# Altium project FMCW-Radar-v1.PrjPcb (part 1 of 3)
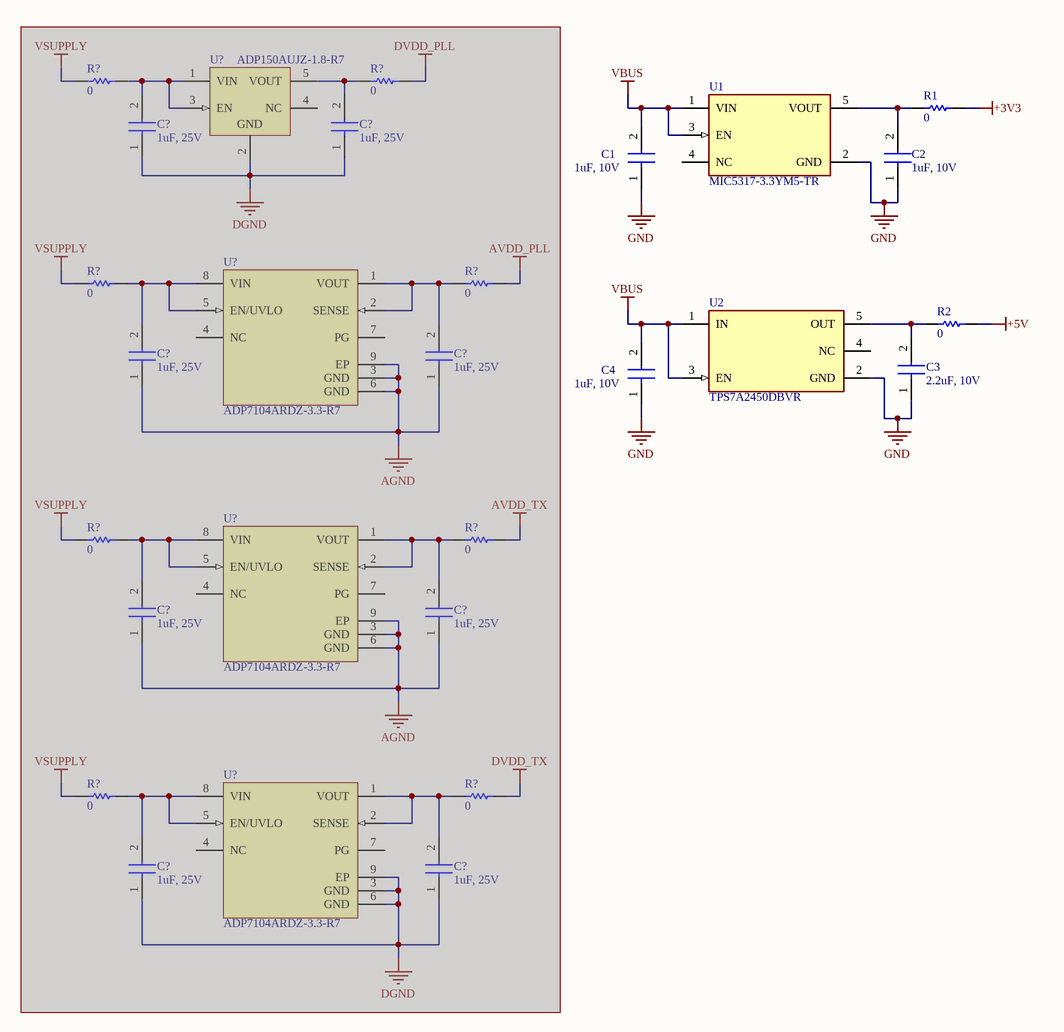
[diagram p0: Power.SchDoc]
4 sheets, 82 parts. Net scope: global (net labels, ports and power ports of the same name join across sheets).
Board file: Radar.PcbDoc
Sheets:
  Power.SchDoc
  Transmitter-2.4GHz.SchDoc
  Receiver-2.4GHz.SchDoc
  MCU.SchDoc

## Sheet Power.SchDoc
size B; SheetNumber: 1; SheetTotal: 4

### Parts
(Parts that share a designator on the sheet are numbered #1, #2 ... from top to bottom, then left to right.)
C1  1uF, 10V  [FP-CL10-IPC_A]
C2  1uF, 10V  [FP-CL10-IPC_A]
C3  2.2uF, 10V  [FP-CL10-IPC_A]
C4  1uF, 10V  [FP-CL10-IPC_A]
C?#1  1uF, 25V  [CAP_CL21B105KAFNNNE_SAM]  (masked out: inside a compile mask, not in the netlist)
C?#2  1uF, 25V  [CAP_CL21B105KAFNNNE_SAM]  (masked out: inside a compile mask, not in the netlist)
C?#3  1uF, 25V  [CAP_CL21B105KAFNNNE_SAM]  (masked out: inside a compile mask, not in the netlist)
C?#4  1uF, 25V  [CAP_CL21B105KAFNNNE_SAM]  (masked out: inside a compile mask, not in the netlist)
C?#5  1uF, 25V  [CAP_CL21B105KAFNNNE_SAM]  (masked out: inside a compile mask, not in the netlist)
C?#6  1uF, 25V  [CAP_CL21B105KAFNNNE_SAM]  (masked out: inside a compile mask, not in the netlist)
C?#7  1uF, 25V  [CAP_CL21B105KAFNNNE_SAM]  (masked out: inside a compile mask, not in the netlist)
C?#8  1uF, 25V  [CAP_CL21B105KAFNNNE_SAM]  (masked out: inside a compile mask, not in the netlist)
R1  0  [RESC1005X40X25ML05T05]
R2  0  [RESC1005X40X25ML05T05]
R?#1  0  [RES_ERJ-6GEY0R00V]  (masked out: inside a compile mask, not in the netlist)
R?#2  0  [RES_ERJ-6GEY0R00V]  (masked out: inside a compile mask, not in the netlist)
R?#3  0  [RES_ERJ-6GEY0R00V]  (masked out: inside a compile mask, not in the netlist)
R?#4  0  [RES_ERJ-6GEY0R00V]  (masked out: inside a compile mask, not in the netlist)
R?#5  0  [RES_ERJ-6GEY0R00V]  (masked out: inside a compile mask, not in the netlist)
R?#6  0  [RES_ERJ-6GEY0R00V]  (masked out: inside a compile mask, not in the netlist)
R?#7  0  [RES_ERJ-6GEY0R00V]  (masked out: inside a compile mask, not in the netlist)
R?#8  0  [RES_ERJ-6GEY0R00V]  (masked out: inside a compile mask, not in the netlist)
U1  MIC5317-3.3YM5-TR  [FP-SOT23-5LD-PL-1-IPC_C]
U2  TPS7A2450DBVR  [FP-DBV0005A-IPC_C]
U?#1  ADP150AUJZ-1.8-R7  (masked out: inside a compile mask, not in the netlist)
U?#2  ADP7104ARDZ-3.3-R7  [ADI-RD-8-2_M]  (masked out: inside a compile mask, not in the netlist)
U?#3  ADP7104ARDZ-3.3-R7  [ADI-RD-8-2_M]  (masked out: inside a compile mask, not in the netlist)
U?#4  ADP7104ARDZ-3.3-R7  [ADI-RD-8-2_M]  (masked out: inside a compile mask, not in the netlist)

### Nets
+3V3: R1.2
+5V: R2.2
GND: C1.1 C2.1 C3.1 C4.1 U1.2(GND) U2.2(GND)
VBUS: C1.2 C4.2 U1.1(VIN) U1.3(EN) U2.1(IN) U2.3(EN)
NetC2_2: C2.2 R1.1 U1.5(VOUT)
NetC3_2: C3.2 R2.1 U2.5(OUT)

Not connected (* = marked no-connect by the designer): U1 4(NC); U2 4(NC)

### Library data of the parts
C1 C2 C4 = CL10B105KP8NNNC: Ceramic Capacitor, Multilayer, Ceramic, 10V, 10% +Tol, 10% -Tol, X7R, 15% TC, 1uF, Surface Mount, 0603; Manufacturer: Samsung; Multilayer: Yes; Supplier: Digikey; Supplier Part Number: 1276-1946-6-ND; Manufacturer Part Number: CL10B105KP8NNNC; RoHS: Yes; Category: Ceramic Capacitors; Stock: 5561968; Pricing: 1=0.08, 10=0.006, 100=0.0056, 1000=0.00528 (USD); Mounting Technology: Surface Mount; Pins: 2; Dielectric Material: Ceramic; Package Shape: Rectangular; Case/Package: 0603; Terminal Finish: Nickel; Min Operating Temperature: -55°C; Max Operating Temperature: 125°C; JESD-609 Code: e3; Value: 1uF; Capacitor Type: Ceramic; Tolerance  (fill in as +-): 10%; Package Style: SMTMeter; Packaging: Tape and Reel; Tolerance (fill in as +-): 10%; Rated DC Voltage (URdc): 10V; Temperature Characteristics Code: X7R; Termination: Wraparound; Length: 1.6mm; Width: 0.8mm; Height: 0.9mm; Reach SVHC Compliant: Yes; RoHS Compliant: Yes; ComponentLink1URL: https://datasheet.ciiva.com:443/pdfs/VipMasterIC/IC/SEMS/SEMS-S-A0008526420/SEMS-S-A0008526450-1.pdf?src-supplier=IHS+Markit; ComponentLink1Description: https://datasheet.ciiva.com:443/pdfs/VipMasterIC/IC/SEMS/SEMS-S-A0008526420/SEMS-S-A0008526450-1.pdf?src-supplier=IHS+Markit; ComponentLink2URL: https://datasheet.ciiva.com/25788/cl10b105kp8nnnc-25788304.pdf?src-supplier=Digikey; ComponentLink2Description: https://datasheet.ciiva.com/25788/cl10b105kp8nnnc-25788304.pdf?src-supplier=Digikey; ComponentLink3URL: https://datasheet.ciiva.com/26838/getdatasheetpartid-358410-26838426.pdf?src-supplier=Verical; ComponentLink3Description: https://datasheet.ciiva.com/26838/getdatasheetpartid-358410-26838426.pdf?src-supplier=Verical; ComponentLink4URL: https://datasheet.ciiva.com/16396/cl10b105kp8nnnc-16396970.pdf?src-supplier=Future+Electronics; ComponentLink4Description: https://datasheet.ciiva.com/16396/cl10b105kp8nnnc-16396970.pdf?src-supplier=Future+Electronics
C3 = CL10B225KP8NNNC: Ceramic Capacitor, Multilayer, Ceramic, 10V, 10% +Tol, 10% -Tol, X7R, 15% TC, 2.2uF, Surface Mount, 0603; Manufacturer: Samsung; Multilayer: Yes; Supplier: Digikey; Supplier Part Number: 1276-1134-1-ND; Manufacturer Part Number: CL10B225KP8NNNC; RoHS: Yes; Category: Ceramic Capacitors; Stock: 86850; Pricing: 1=0.08, 10=0.017, 100=0.0136, 1000=0.01206 (USD); Mounting Technology: Surface Mount; Pins: 2; Dielectric Material: Ceramic; Package Shape: Rectangular; Case/Package: 0603; Terminal Finish: Nickel; Min Operating Temperature: -55°C; Max Operating Temperature: 125°C; JESD-609 Code: e3; Value: 2.2uF; Capacitor Type: Ceramic; Tolerance  (fill in as +-): 10%; Package Style: SMTMeter; Packaging: Tape and Reel; Tolerance (fill in as +-): 10%; Rated DC Voltage (URdc): 10V; Temperature Characteristics Code: X7R; Termination: Wraparound; Length: 1.6mm; Width: 0.8mm; Height: 0.9mm; Reach SVHC Compliant: Yes; RoHS Compliant: Yes; ComponentLink1URL: https://datasheet.ciiva.com:443/pdfs/VipMasterIC/IC/SEMS/SEMS-S-A0008384515/SEMS-S-A0008873307-1.pdf?src-supplier=IHS+Markit; ComponentLink1Description: https://datasheet.ciiva.com:443/pdfs/VipMasterIC/IC/SEMS/SEMS-S-A0008384515/SEMS-S-A0008873307-1.pdf?src-supplier=IHS+Markit; ComponentLink2URL: https://datasheet.ciiva.com/25798/cl10b225kp8nnnc-25798914.pdf?src-supplier=Digikey; ComponentLink2Description: https://datasheet.ciiva.com/25798/cl10b225kp8nnnc-25798914.pdf?src-supplier=Digikey; ComponentLink3URL: https://datasheet.ciiva.com/15227/getdatasheetpartid-359568-15227195.pdf?src-supplier=Verical; ComponentLink3Description: https://datasheet.ciiva.com/15227/getdatasheetpartid-359568-15227195.pdf?src-supplier=Verical; ComponentLink4URL: https://datasheet.ciiva.com/16500/cl10b225kp8nnnc-16500695.pdf?src-supplier=Future+Electronics; ComponentLink4Description: https://datasheet.ciiva.com/16500/cl10b225kp8nnnc-16500695.pdf?src-supplier=Future+Electronics; ComponentLink5URL: https://datasheet.ciiva.com/29198/457933-da-01-en-vs-kondensator-0603-29198589.pdf?src-supplier=Conrad; ComponentLink5Description: https://datasheet.ciiva.com/29198/457933-da-01-en-vs-kondensator-0603-29198589.pdf?src-supplier=Conrad
C?#1-C?#8 = CL21B105KAFNNNE: Ceramic Capacitor, Multilayer, Ceramic, 25V, 10% +Tol, 10% -Tol, X7R, 15% TC, 1uF, Surface Mount, 0805; Manufacturer: Samsung; Multilayer: Yes; Supplier: Digikey; Supplier Part Number: 1276-1066-1-ND; Manufacturer Part Number: CL21B105KAFNNNE; RoHS: Yes; Category: Ceramic Capacitors; Stock: 34526; Pricing: 1=0.08, 10=0.026, 100=0.0192, 1000=0.0144, 2000=0.00735 (USD); Mounting Technology: Surface Mount; Pins: 2; Dielectric Material: Ceramic; Package Shape: Rectangular; Case/Package: 0805; Terminal Finish: Nickel; Min Operating Temperature: -55°C; Max Operating Temperature: 125°C; JESD-609 Code: e3; Value: 1uF; Capacitor Type: Ceramic; Tolerance  (fill in as +-): 10%; Package Style: SMTMeter; Packaging: Tape and Reel; Tolerance (fill in as +-): 10%; Rated DC Voltage (URdc): 25V; Temperature Characteristics Code: X7R; Termination: Wraparound; Length: 2mm; Width: 1.25mm; Height: 1.35mm; Reach SVHC Compliant: Yes; RoHS Compliant: Yes; ComponentLink1URL: https://datasheet.ciiva.com:443/pdfs/VipMasterIC/IC/SEMS/SEMS-S-A0008523501/SEMS-S-A0008523563-1.pdf?src-supplier=IHS+Markit; ComponentLink1Description: https://datasheet.ciiva.com:443/pdfs/VipMasterIC/IC/SEMS/SEMS-S-A0008523501/SEMS-S-A0008523563-1.pdf?src-supplier=IHS+Markit; ComponentLink2URL: https://datasheet.ciiva.com/25800/cl21b105kafnnne-25800163.pdf?src-supplier=Digikey; ComponentLink2Description: https://datasheet.ciiva.com/25800/cl21b105kafnnne-25800163.pdf?src-supplier=Digikey; ComponentLink3URL: https://datasheet.ciiva.com/15195/getdatasheetpartid-355205-15195880.pdf?src-supplier=Verical; ComponentLink3Description: https://datasheet.ciiva.com/15195/getdatasheetpartid-355205-15195880.pdf?src-supplier=Verical
R1 R2 = ERJ-3GEY0R00V: Fixed Resistor, Metal Glaze/thick Film, 0.1W, 0ohm, Surface Mount, 0603; Manufacturer: Panasonic; Power: 100mW; Rated Temperature: 70°C; Value: 0R; Package Height: 0.45mm; Package Length: 1.6mm; Package Width: 0.8mm; Reference Standard: AEC-Q200; Supplier: Digikey; Supplier Part Number: P0.0GCT-ND; Manufacturer Part Number: ERJ-3GEY0R00V; RoHS: Yes; Category: Chip SMD Resistors; Stock: 690397; Pricing: 1=0.1, 10=0.02, 25=0.0164, 50=0.0144, 100=0.0126, 250=0.0106, 500=0.00936, 1000=0.0083, 5000=0.0064, 10000=0.00578, 15000=0.00546, 25000=0.0051, 35000=0.00489, 50000=0.00468, 125000=0.00421, 250000=0.00392, 500000=0.00367 (USD); Mounting Technology: Surface Mount; Pins: 2; Package Shape: Rectangular; Case/Package: 0603; Terminal Finish: Nickel; Min Operating Temperature: -55°C; Max Operating Temperature: 155°C; JESD-609 Code: e3; Resistor Type: FIXED RESISTOR; Construction: Rectangular; Packaging: Tape and Reel; Technology: METAL GLAZE/THICK FILM; Termination: Wraparound; Reach SVHC Compliant: Yes; RoHS Compliant: Yes; ComponentLink1URL: https://datasheet.ciiva.com:443/pdfs/VipMasterIC/IC/PANA/PANA-S-A0009459603/PANA-S-A0009459603-1.pdf?src-supplier=IHS+Markit; ComponentLink1Description: https://datasheet.ciiva.com:443/pdfs/VipMasterIC/IC/PANA/PANA-S-A0009459603/PANA-S-A0009459603-1.pdf?src-supplier=IHS+Markit; ComponentLink2URL: https://datasheet.ciiva.com/11808/0900766b80f806dd-11808207.pdf?src-supplier=Rs; ComponentLink2Description: https://datasheet.ciiva.com/11808/0900766b80f806dd-11808207.pdf?src-supplier=Rs; ComponentLink3URL: https://datasheet.ciiva.com/27055/1935748-27055113.pdf?src-supplier=Jameco; ComponentLink3Description: https://datasheet.ciiva.com/27055/1935748-27055113.pdf?src-supplier=Jameco; ComponentLink4URL: https://datasheet.ciiva.com/43460/1678796-43460647.pdf?src-supplier=Farnell; ComponentLink4Description: https://datasheet.ciiva.com/43460/1678796-43460647.pdf?src-supplier=Farnell; ComponentLink5URL: https://datasheet.ciiva.com/28695/1678796-28695833.pdf?src-supplier=Element14; ComponentLink5Description: https://datasheet.ciiva.com/28695/1678796-28695833.pdf?src-supplier=Element14; ComponentLink6URL: https://datasheet.ciiva.com/5959/1678796-5959707.pdf?src-supplier=Farnell; ComponentLink6Description: https://datasheet.ciiva.com/5959/1678796-5959707.pdf?src-supplier=Farnell; ComponentLink7URL: https://datasheet.ciiva.com/48532/aoa0000ce1-48532165.pdf?src-supplier=Avnet; ComponentLink7Description: https://datasheet.ciiva.com/48532/aoa0000ce1-48532165.pdf?src-supplier=Avnet; ComponentLink8URL: https://datasheet.ciiva.com/30199/4aoa0000ce1-30199822.pdf?src-supplier=Onlinecomponents.com; ComponentLink8Description: https://datasheet.ciiva.com/30199/4aoa0000ce1-30199822.pdf?src-supplier=Onlinecomponents.com; ComponentLink9URL: https://datasheet.ciiva.com/16834/aoa0000ce1-16834828.pdf?src-supplier=Future+Electronics; ComponentLink9Description: https://datasheet.ciiva.com/16834/aoa0000ce1-16834828.pdf?src-supplier=Future+Electronics; ComponentLink10URL: https://datasheet.ciiva.com/16758/70255313-16758527.pdf?src-supplier=Allied+Electronics; ComponentLink10Description: https://datasheet.ciiva.com/16758/70255313-16758527.pdf?src-supplier=Allied+Electronics; ComponentLink11URL: https://datasheet.ciiva.com/46377/1678796-46377868.pdf?src-supplier=Element14; ComponentLink11Description: https://datasheet.ciiva.com/46377/1678796-46377868.pdf?src-supplier=Element14; ComponentLink12URL: https://datasheet.ciiva.com/9198/aoa0000ce1-9198975.pdf?src-supplier=Avnet; ComponentLink12Description: https://datasheet.ciiva.com/9198/aoa0000ce1-9198975.pdf?src-supplier=Avnet
R?#1-R?#8 = ERJ-6GEY0R00V: Fixed Resistor, Metal Glaze/thick Film, 0.125W, 0ohm, Surface Mount, 0805; Manufacturer: Panasonic; Power: 125mW; Rated Temperature: 70°C; Value: 0R; Package Height: 0.6mm; Package Length: 2mm; Package Width: 1.25mm; Reference Standard: AEC-Q200; Supplier: Digikey; Supplier Part Number: P0.0ACT-ND; Manufacturer Part Number: ERJ-6GEY0R00V; RoHS: Yes; Category: Chip SMD Resistors; Stock: 3178323; Pricing: 1=0.1, 10=0.028, 25=0.0236, 50=0.0204, 100=0.0179, 250=0.01516, 500=0.01342, 1000=0.01193 (USD); Mounting Technology: Surface Mount; Pins: 2; Package Shape: Rectangular; Case/Package: 0805; Terminal Finish: Nickel; Min Operating Temperature: -55°C; Max Operating Temperature: 155°C; JESD-609 Code: e3; Resistor Type: FIXED RESISTOR; Construction: Rectangular; Packaging: Tape and Reel; Technology: METAL GLAZE/THICK FILM; Termination: Wraparound; Reach SVHC Compliant: Yes; RoHS Compliant: Yes; ComponentLink1URL: https://datasheet.ciiva.com:443/pdfs/VipMasterIC/IC/PANA/PANA-S-A0009459603/PANA-S-A0009459603-1.pdf?src-supplier=IHS+Markit; ComponentLink1Description: https://datasheet.ciiva.com:443/pdfs/VipMasterIC/IC/PANA/PANA-S-A0009459603/PANA-S-A0009459603-1.pdf?src-supplier=IHS+Markit; ComponentLink2URL: https://datasheet.ciiva.com/11821/0900766b80f806dd-11821735.pdf?src-supplier=Rs; ComponentLink2Description: https://datasheet.ciiva.com/11821/0900766b80f806dd-11821735.pdf?src-supplier=Rs; ComponentLink3URL: https://datasheet.ciiva.com/28695/1678796-28695877.pdf?src-supplier=Element14; ComponentLink3Description: https://datasheet.ciiva.com/28695/1678796-28695877.pdf?src-supplier=Element14; ComponentLink4URL: https://datasheet.ciiva.com/46377/1678796-46377866.pdf?src-supplier=Element14; ComponentLink4Description: https://datasheet.ciiva.com/46377/1678796-46377866.pdf?src-supplier=Element14; ComponentLink5URL: https://datasheet.ciiva.com/43460/1678796-43460073.pdf?src-supplier=Farnell; ComponentLink5Description: https://datasheet.ciiva.com/43460/1678796-43460073.pdf?src-supplier=Farnell; ComponentLink6URL: https://datasheet.ciiva.com/9117/aoa0000ce1-9117354.pdf?src-supplier=Avnet; ComponentLink6Description: https://datasheet.ciiva.com/9117/aoa0000ce1-9117354.pdf?src-supplier=Avnet
U1 = MIC5317-3.3YM5-TR: Fixed Positive LDO Regulator, 3.3V, 0.31V Dropout, CMOS, PDSO5; Manufacturer: Microchip; Package Body Material: Plastic; Dropout Voltage1-Max: 310mV; Max Supply Voltage: 6V; Min Input Voltage: 4.3V; Channels: 1; Output Current1-Max: 150mA; Output Voltage1-Max: 3.399V; Output Voltage1-Min: 3.201V; Regulator Type: FIXED POSITIVE SINGLE OUTPUT LDO REGULATOR; Supplier: Digikey; Supplier Part Number: MIC5317-3.3YM5-CT-ND; Manufacturer Part Number: MIC5317-3.3YM5-TR; RoHS: No; Category: Voltage Regulators - Linear; Stock: 26650; Pricing: 1=0.22, 25=0.18, 100=0.16, 3000=0.16 (USD); Case/Package: LSSOP; Pins: 5; Package Shape: Rectangular; JESD-30 Code: R-PDSO-G5; Operating Temperature, TJ-Max: 125°C; Operating Temperature, TJ-Min: -40°C; Output Voltage1-Nom: 3.3V; Package Style: SMALL OUTLINE, LOW PROFILE, SHRINK PITCHMeter; Surface Mount: Yes; Technology: CMOS; Terminal Form: Gull Wing; Terminal Position: DUAL; Length: 2.9mm; Width: 1.6mm; Height - Seated (Max): 1.45mm; Terminal Pitch: 0.95mm; Reach SVHC Compliant: Yes; ComponentLink1URL: https://datasheet.ciiva.com:443/pdfs/VipMasterIC/IC/MCRL/MCRLS06213/MCRLS06213-1.pdf?src-supplier=IHS+Markit; ComponentLink1Description: https://datasheet.ciiva.com:443/pdfs/VipMasterIC/IC/MCRL/MCRLS06213/MCRLS06213-1.pdf?src-supplier=IHS+Markit; ComponentLink2URL: http://components.arrow.com/part/dataview/62845788S774067N1374?src-supplier=Arrow+Electronics; ComponentLink2Description: http://components.arrow.com/part/dataview/62845788S774067N1374?src-supplier=Arrow+Electronics; ComponentLink3URL: http://www.microchip.com/mymicrochip/filehandler.aspx?ddocname=en579427&src-supplier=Digikey; ComponentLink3Description: http://www.microchip.com/mymicrochip/filehandler.aspx?ddocname=en579427&src-supplier=Digikey; ComponentLink4URL: https://datasheet.octopart.com/MIC5317-3.3YM5-TR-Microchip-datasheet-26354330.pdf?src-supplier=Element14; ComponentLink4Description: https://datasheet.octopart.com/MIC5317-3.3YM5-TR-Microchip-datasheet-26354330.pdf?src-supplier=Element14
U2 = TPS7A2450DBVR: Fixed Positive LDO Regulator, 5V, 0.25V Dropout, PDSO5; Manufacturer: Texas Instruments; Supplier: Digikey; Supplier Part Number: 296-TPS7A2450DBVRCT-ND; Manufacturer Part Number: TPS7A2450DBVR; RoHS: Yes; Category: Voltage Regulators - Linear; Stock: 4495; Pricing: 1=0.52, 10=0.362, 25=0.324, 100=0.2817, 250=0.26148, 500=0.24932, 1000=0.23931 (USD); ComponentLink1URL: http://www.ti.com/general/docs/suppproductinfo.tsp?distId=10&amp;gotoUrl=http%3A%2F%2Fwww.ti.com%2Flit%2Fgpn%2Ftps7a24&src-supplier=Digikey; ComponentLink1Description: http://www.ti.com/general/docs/suppproductinfo.tsp?distId=10&amp;gotoUrl=http%3A%2F%2Fwww.ti.com%2Flit%2Fgpn%2Ftps7a24&src-supplier=Digikey
U?#1 = ADP150AUJZ-1.8-R7: Fixed Positive LDO Regulator, 1.8V, CMOS, PDSO5; Manufacturer: Analog Devices; Package Body Material: Plastic; Dropout Voltage1-Nom: 105mV; Input Voltage Absolute-Max: 6.5V; Max Supply Voltage: 5.5V; Min Input Voltage: 2.2V; Channels: 1; Output Current1-Max: 150mA; Output Voltage1-Max: 1.827V; Output Voltage1-Min: 1.755V; Package Equivalence Code: TSOP5/6,.11,37; Regulator Type: FIXED POSITIVE SINGLE OUTPUT LDO REGULATOR; Time @ Peak Reflow Temperature-Max (s): 40s; Voltage Tolerance-Max: 2.5%; Qualification Status: Not Qualified; Supplier: Mouser; Supplier Part Number: 584-ADP150AUJZ-1.8R7; Manufacturer Part Number: ADP150AUJZ-1.8-R7; RoHS: Yes; Category: Voltage Regulators - Linear; Stock: 3489; Pricing: 1=1.24, 10=0.902, 50=0.817, 100=0.723, 1000=0.605, 10000=0.559 (USD); Case/Package: VSSOP; Pins: 5; Package Shape: Rectangular; Terminal Finish: Tin; JESD-609 Code: e3; Adjustability: FIXED; JESD-30 Code: R-PDSO-G5; Moisture Sensitivity Level: 1; Number of Outputs: 1; Operating Temperature, TJ-Max: 125°C; Operating Temperature, TJ-Min: -40°C; Output Voltage1-Nom: 1.8V; Packaging: Tape and Reel; Peak Reflow Temperature (Cel): 260°C; Surface Mount: Yes; Technology: CMOS; Terminal Form: Gull Wing; Terminal Position: DUAL; Length: 2.9mm; Width: 1.6mm; Height - Seated (Max): 1mm; Terminal Pitch: 0.95mm; Reach SVHC Compliant: Yes; RoHS Compliant: Yes; ComponentLink1URL: https://datasheet.ciiva.com:443/pdfs/VipMasterIC/IC/ANDI/ANDI-S-A0001491086/ANDI-S-A0001491086-1.pdf?src-supplier=IHS+Markit; ComponentLink1Description: https://datasheet.ciiva.com:443/pdfs/VipMasterIC/IC/ANDI/ANDI-S-A0001491086/ANDI-S-A0001491086-1.pdf?src-supplier=IHS+Markit; ComponentLink2URL: https://datasheet.ciiva.com/2040/adp150-2040604.pdf?src-supplier=Digikey; ComponentLink2Description: https://datasheet.ciiva.com/2040/adp150-2040604.pdf?src-supplier=Digikey; ComponentLink3URL: https://datasheet.ciiva.com/2040/adp150-2040605.pdf?src-supplier=Digikey; ComponentLink3Description: https://datasheet.ciiva.com/2040/adp150-2040605.pdf?src-supplier=Digikey; ComponentLink4URL: https://datasheet.ciiva.com/2040/adp150-2040606.pdf?src-supplier=Digikey; ComponentLink4Description: https://datasheet.ciiva.com/2040/adp150-2040606.pdf?src-supplier=Digikey
U?#2-U?#4 = ADP7104ARDZ-3.3-R7: Fixed Positive LDO Regulator, 3.3V, 0.55V Dropout, CMOS, PDSO8; Manufacturer: Analog Devices; Package Body Material: Plastic; Dropout Voltage1-Nom: 350mV; Channels: 1; Output Current1-Max: 500mA; Output Voltage1-Max: 3.333V; Output Voltage1-Min: 3.234V; Package Equivalence Code: SOP8,.25; Regulator Type: FIXED POSITIVE SINGLE OUTPUT LDO REGULATOR; Dropout Voltage1-Max: 550mV; Input Voltage Absolute-Max: 22V; Max Supply Voltage: 20V; Line Regulation-Max: 0.0078%; Voltage Tolerance-Max: 2%; Qualification Status: Not Qualified; Supplier: Digikey; Supplier Part Number: 505-ADP7104ARDZ-3.3-R7CT-ND; Manufacturer Part Number: ADP7104ARDZ-3.3-R7; RoHS: Yes; Category: Voltage Regulators - Linear; Stock: 2731; Pricing: 1=7, 10=4.65, 25=4.0376, 100=3.3446, 250=3.00444, 500=2.825 (USD); Case/Package: HSOP; Pins: 8; Package Shape: Rectangular; Terminal Finish: Tin; Adjustability: FIXED; JESD-30 Code: R-PDSO-G8; Operating Temperature, TJ-Max: 125°C; Operating Temperature, TJ-Min: -40°C; Package Style: SMALL OUTLINE, HEAT SINK/SLUGMeter; Packaging: Tape and Reel; Surface Mount: Yes; Technology: CMOS; Terminal Form: Gull Wing; Terminal Position: DUAL; Min Input Voltage: 3.3V; Number of Outputs: 1; Output Voltage1-Nom: 3.3V; JESD-609 Code: e3; Moisture Sensitivity Level: 3; Length: 4.9mm; Width: 3.9mm; Height - Seated (Max): 1.75mm; Terminal Pitch: 1.27mm; Reach SVHC Compliant: Yes; RoHS Compliant: Yes; ComponentLink1URL: https://datasheet.ciiva.com:443/pdfs/VipMasterIC/IC/ANDI/ANDI-S-A0008998722/ANDI-S-A0008998722-1.pdf?src-supplier=IHS+Markit; ComponentLink1Description: https://datasheet.ciiva.com:443/pdfs/VipMasterIC/IC/ANDI/ANDI-S-A0008998722/ANDI-S-A0008998722-1.pdf?src-supplier=IHS+Markit; ComponentLink2URL: https://datasheet.ciiva.com/6589/adp7104-6589770.pdf?src-supplier=Digikey; ComponentLink2Description: https://datasheet.ciiva.com/6589/adp7104-6589770.pdf?src-supplier=Digikey; ComponentLink3URL: https://datasheet.ciiva.com/6589/adp7104-6589771.pdf?src-supplier=Digikey; ComponentLink3Description: https://datasheet.ciiva.com/6589/adp7104-6589771.pdf?src-supplier=Digikey; ComponentLink4URL: https://datasheet.ciiva.com/6589/adp7104-6589773.pdf?src-supplier=Digikey; ComponentLink4Description: https://datasheet.ciiva.com/6589/adp7104-6589773.pdf?src-supplier=Digikey; ComponentLink5URL: https://datasheet.ciiva.com/8241/adp7104-8241802.pdf?src-supplier=Avnet; ComponentLink5Description: https://datasheet.ciiva.com/8241/adp7104-8241802.pdf?src-supplier=Avnet

## Sheet Transmitter-2.4GHz.SchDoc
size B; SheetNumber: 2; SheetTotal: 4
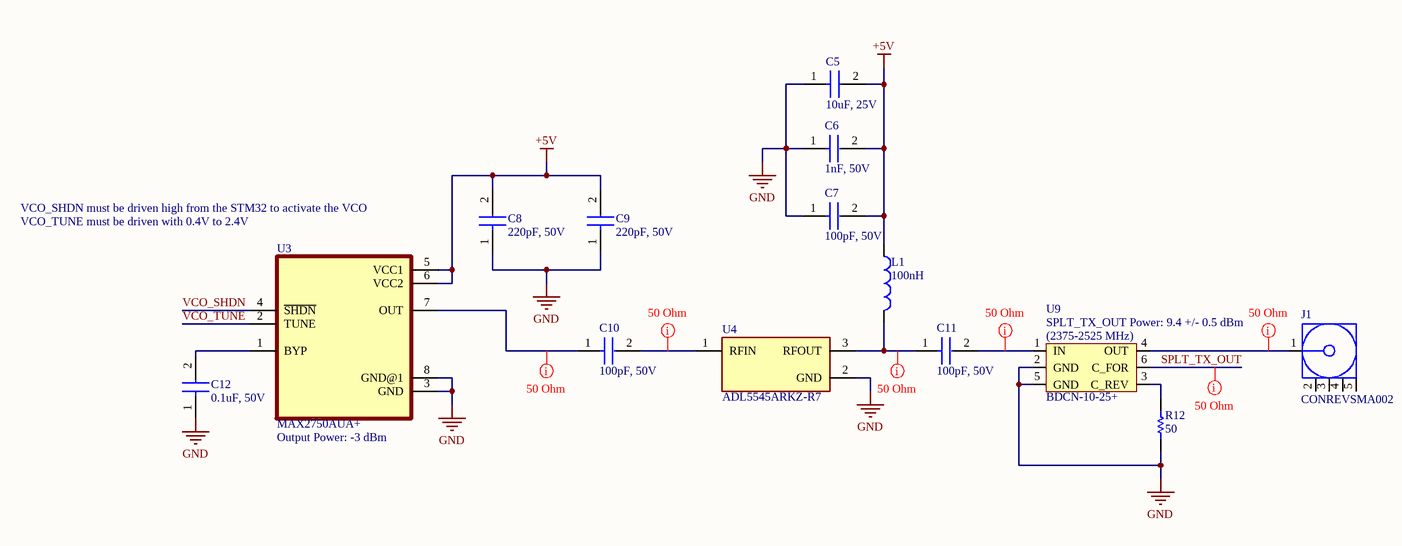
[diagram p1: Transmitter-2.4GHz.SchDoc]

### Parts
C5  10uF, 25V  [CAP_CL31_SAM]
C6  1nF, 50V  [FP-0603-L_1_6_0_15-W_0_81-IPC_C]
C7  100pF, 50V  [CAPC17595_87N_KEM]
C8  220pF, 50V  [CAPC17595_87N_KEM]
C9  220pF, 50V  [CAPC17595_87N_KEM]
C10  100pF, 50V  [CAP_CC0402_YAG]
C11  100pF, 50V  [CAP_CC0402_YAG]
C12  0.1uF, 50V  [CAP_CC0603_YAG-M]
J1  CONREVSMA002  [CON-REVSMA-RA]
L1  100nH  [INDC1608X95N]
R12  50  [RESC1005X35N]
U3  MAX2750AUA+  [SOP65P490X110-8N]
U4  ADL5545ARKZ-R7  [ADL5545ARKZ-R7]
U9  BDCN-10-25+  [BDCN-10-25+]

### Nets
+5V: C5.2 C6.2 C7.2 C8.2 C9.2 L1.1 U3.5(VCC1) U3.6(VCC2)
GND: C5.1 C6.1 C7.1 C8.1 C9.1 C12.1 R12.1 U3.3(GND) U3.8(GND@1) U4.2(GND) U9.2(GND) U9.5(GND)
SPLT_TX_OUT: U9.6(C_FOR)
VCO_SHDN: U3.4(~{SHDN})
VCO_TUNE: U3.2(TUNE)
NetC10_1: C10.1 U3.7(OUT)
NetC10_2: C10.2 U4.1(RFIN)
NetC11_1: C11.1 L1.2 U4.3(RFOUT)
NetC11_2: C11.2 U9.1(IN)
NetC12_2: C12.2 U3.1(BYP)
NetJ1_1: J1.1(Signal) U9.4(OUT)
NetR12_2: R12.2 U9.3(C_REV)

Not connected (* = marked no-connect by the designer): J1 2(GND) 3(GND) 4(GND) 5(GND)

### Layout directives
net class RF_Trace: NetC10_1, NetC10_2, NetC11_1, NetC11_2, NetJ1_1, SPLT_TX_OUT

### Notes on the sheet
- VCO_SHDN must be driven high from the STM32 to activate the VCO
- (near U3) VCO_TUNE must be driven with 0.4V to 2.4V
- (near U9) SPLT_TX_OUT Power: 9.4 +/- 0.5 dBm
- (near U9) (2375-2525 MHz)
- (near U3) Output Power: -3 dBm

### Library data of the parts
C5 = CL31B106KAHNNNE: Ceramic Capacitor, Multilayer, Ceramic, 25V, 10% +Tol, 10% -Tol, X7R, 15% TC, 10uF, Surface Mount, 1206; Manufacturer: Samsung; Multilayer: Yes; Supplier: Digikey; Supplier Part Number: 1276-1804-1-ND; Manufacturer Part Number: CL31B106KAHNNNE; RoHS: Yes; Category: Ceramic Capacitors; Stock: 2651645; Pricing: 1=0.1, 10=0.043, 100=0.0358 (USD); Mounting Technology: Surface Mount; Pins: 2; Dielectric Material: Ceramic; Package Shape: Rectangular; Case/Package: 1206; Terminal Finish: Nickel; Min Operating Temperature: -55°C; Max Operating Temperature: 125°C; JESD-609 Code: e3; Value: 10uF; Capacitor Type: Ceramic; Tolerance  (fill in as +-): 10%; Package Style: SMTMeter; Packaging: Tape and Reel; Tolerance (fill in as +-): 10%; Rated DC Voltage (URdc): 25V; Temperature Characteristics Code: X7R; Termination: Wraparound; Length: 3.2mm; Width: 1.6mm; Height: 1.8mm; Reach SVHC Compliant: Yes; RoHS Compliant: Yes; ComponentLink1URL: https://datasheet.ciiva.com:443/pdfs/VipMasterIC/IC/SEMS/SEMS-S-A0008384515/SEMS-S-A0008872888-1.pdf?src-supplier=IHS+Markit; ComponentLink1Description: https://datasheet.ciiva.com:443/pdfs/VipMasterIC/IC/SEMS/SEMS-S-A0008384515/SEMS-S-A0008872888-1.pdf?src-supplier=IHS+Markit; ComponentLink2URL: https://datasheet.ciiva.com/25795/cl31b106kahnnne-25795260.pdf?src-supplier=Digikey; ComponentLink2Description: https://datasheet.ciiva.com/25795/cl31b106kahnnne-25795260.pdf?src-supplier=Digikey; ComponentLink3URL: https://datasheet.ciiva.com/26838/getdatasheetpartid-356415-26838914.pdf?src-supplier=Verical; ComponentLink3Description: https://datasheet.ciiva.com/26838/getdatasheetpartid-356415-26838914.pdf?src-supplier=Verical; ComponentLink4URL: https://datasheet.ciiva.com/16498/cl03a105mq3csnc-16498474.pdf?src-supplier=Future+Electronics; ComponentLink4Description: https://datasheet.ciiva.com/16498/cl03a105mq3csnc-16498474.pdf?src-supplier=Future+Electronics
C6 = 06035A102JAT2A: Ceramic Capacitor, Multilayer, Ceramic, 50V, 5% +Tol, 5% -Tol, C0G, 30ppm/Cel TC, 0.001uF, Surface Mount, 0603; Manufacturer: Kyocera AVX; Multilayer: Yes; Supplier: Digikey; Supplier Part Number: 478-KGM15ACG1H102JTCT-ND; Manufacturer Part Number: 06035A102JAT2A; RoHS: Yes; Category: Ceramic Capacitors; Stock: 540000; Pricing: 4000=0.00488, 8000=0.00454, 16000=0.00447, 24000=0.00439, 32000=0.00431 (USD); Mounting Technology: Surface Mount; Pins: 2; Dielectric Material: Ceramic; Package Shape: Rectangular; Case/Package: 0603; Terminal Finish: Nickel; Min Operating Temperature: -55°C; Max Operating Temperature: 125°C; JESD-609 Code: e3; Value: 1nF; Capacitor Type: Ceramic; Tolerance  (fill in as +-): 5%; Package Style: SMTMeter; Packaging: Tape and Reel; Tolerance (fill in as +-): 5%; Rated DC Voltage (URdc): 50V; Temperature Characteristics Code: C0G; Termination: Wraparound; Length: 1.6mm; Width: 0.81mm; Height: 0.9mm; RoHS Compliant: Yes; Reach SVHC Compliant: Yes; ComponentLink1URL: https://datasheet.ciiva.com:443/pdfs/VipMasterIC/IC/AVXC/AVXC-S-A0008899940/AVXC-S-A0008899940-1.pdf?src-supplier=IHS+Markit; ComponentLink1Description: https://datasheet.ciiva.com:443/pdfs/VipMasterIC/IC/AVXC/AVXC-S-A0008899940/AVXC-S-A0008899940-1.pdf?src-supplier=IHS+Markit; ComponentLink2URL: https://datasheet.ciiva.com/11786/0900766b802d4697-11786950.pdf?src-supplier=Rs; ComponentLink2Description: https://datasheet.ciiva.com/11786/0900766b802d4697-11786950.pdf?src-supplier=Rs; ComponentLink3URL: https://datasheet.ciiva.com/11464/ccog-11464573.pdf?src-supplier=Avnet; ComponentLink3Description: https://datasheet.ciiva.com/11464/ccog-11464573.pdf?src-supplier=Avnet; ComponentLink4URL: https://datasheet.ciiva.com/16363/ccog-16363640.pdf?src-supplier=Future+Electronics; ComponentLink4Description: https://datasheet.ciiva.com/16363/ccog-16363640.pdf?src-supplier=Future+Electronics; ComponentLink5URL: https://datasheet.ciiva.com/1124/759117-1124717.pdf?src-supplier=Element14; ComponentLink5Description: https://datasheet.ciiva.com/1124/759117-1124717.pdf?src-supplier=Element14; ComponentLink6URL: https://datasheet.ciiva.com/1124/759117-1124716.pdf?src-supplier=Element14; ComponentLink6Description: https://datasheet.ciiva.com/1124/759117-1124716.pdf?src-supplier=Element14; ComponentLink7URL: https://datasheet.ciiva.com/1466/26712-1466099.pdf?src-supplier=Farnell; ComponentLink7Description: https://datasheet.ciiva.com/1466/26712-1466099.pdf?src-supplier=Farnell; ComponentLink8URL: https://datasheet.ciiva.com/1124/26712-1124715.pdf?src-supplier=Element14; ComponentLink8Description: https://datasheet.ciiva.com/1124/26712-1124715.pdf?src-supplier=Element14; ComponentLink9URL: https://datasheet.ciiva.com/150/ccog-150886.pdf?src-supplier=Digikey; ComponentLink9Description: https://datasheet.ciiva.com/150/ccog-150886.pdf?src-supplier=Digikey; ComponentLink10URL: https://datasheet.ciiva.com/150/ccog-150885.pdf?src-supplier=Digikey; ComponentLink10Description: https://datasheet.ciiva.com/150/ccog-150885.pdf?src-supplier=Digikey; ComponentLink11URL: https://datasheet.ciiva.com/150/ccog-150887.pdf?src-supplier=Digikey; ComponentLink11Description: https://datasheet.ciiva.com/150/ccog-150887.pdf?src-supplier=Digikey; ComponentLink12URL: https://datasheet.ciiva.com/14585/70001039-14585948.pdf?src-supplier=Allied+Electronics; ComponentLink12Description: https://datasheet.ciiva.com/14585/70001039-14585948.pdf?src-supplier=Allied+Electronics
C7 = C0603C101J5GACTU: Ceramic Capacitor, Multilayer, Ceramic, 50V, 5% +Tol, 5% -Tol, C0G, 30ppm/Cel TC, 0.0001uF, Surface Mount, 0603; Manufacturer: KEMET; Multilayer: Yes; Supplier: Digikey; Supplier Part Number: 399-C0603C101J5GACTUCT-ND; Manufacturer Part Number: C0603C101J5GACTU; RoHS: Yes; Category: Ceramic Capacitors; Stock: 772000; Pricing: 4000=0.0155, 8000=0.0104 (USD); Mounting Technology: Surface Mount; Pins: 2; Dielectric Material: Ceramic; Package Shape: Rectangular; Case/Package: 0603; Terminal Finish: Nickel; Min Operating Temperature: -55°C; Max Operating Temperature: 125°C; JESD-609 Code: e3; Value: 100pF; Capacitor Type: Ceramic; Tolerance  (fill in as +-): 5%; Package Style: SMTMeter; Packaging: Tape and Reel; Tolerance (fill in as +-): 5%; Rated DC Voltage (URdc): 50V; Temperature Characteristics Code: C0G; Termination: Wraparound; Length: 1.6mm; Width: 0.8mm; Height: 0.8mm; Reach SVHC Compliant: Yes; RoHS Compliant: Yes; ComponentLink1URL: https://datasheet.ciiva.com:443/pdfs/VipMasterIC/IC/KEME/KEME-S-A0005605168/KEME-S-A0005605168-1.pdf?src-supplier=IHS+Markit; ComponentLink1Description: https://datasheet.ciiva.com:443/pdfs/VipMasterIC/IC/KEME/KEME-S-A0005605168/KEME-S-A0005605168-1.pdf?src-supplier=IHS+Markit; ComponentLink2URL: https://datasheet.ciiva.com/6126/f9080b-0402-series-c0g-6126680.pdf?src-supplier=Farnell; ComponentLink2Description: https://datasheet.ciiva.com/6126/f9080b-0402-series-c0g-6126680.pdf?src-supplier=Farnell; ComponentLink3URL: https://datasheet.ciiva.com/28645/1789732-28645525.pdf?src-supplier=Element14; ComponentLink3Description: https://datasheet.ciiva.com/28645/1789732-28645525.pdf?src-supplier=Element14; ComponentLink4URL: https://datasheet.ciiva.com/7823/1725423-7823564.pdf?src-supplier=Element14; ComponentLink4Description: https://datasheet.ciiva.com/7823/1725423-7823564.pdf?src-supplier=Element14; ComponentLink5URL: https://datasheet.ciiva.com/7823/1725423-7823565.pdf?src-supplier=Element14; ComponentLink5Description: https://datasheet.ciiva.com/7823/1725423-7823565.pdf?src-supplier=Element14; ComponentLink6URL: https://datasheet.ciiva.com/7823/f9080b-0402-series-c0g-7823964.pdf?src-supplier=Element14; ComponentLink6Description: https://datasheet.ciiva.com/7823/f9080b-0402-series-c0g-7823964.pdf?src-supplier=Element14; ComponentLink7URL: https://datasheet.ciiva.com/7823/1372242-7823965.pdf?src-supplier=Element14; ComponentLink7Description: https://datasheet.ciiva.com/7823/1372242-7823965.pdf?src-supplier=Element14
C8 C9 = C0603C221J5GAC7411: Ceramic Capacitor, Multilayer, Ceramic, 50V, 5% +Tol, 5% -Tol, C0G, 30ppm/Cel TC, 0.00022uF, Surface Mount, 0603; Manufacturer: KEMET; Multilayer: Yes; Supplier: Digikey; Supplier Part Number: 399-C0603C221J5GAC7411CT-ND; Manufacturer Part Number: C0603C221J5GAC7411; RoHS: Yes; Category: Ceramic Capacitors; Stock: 30000; Pricing: 15000=0.0071, 30000=0.007, 45000=0.0069, 75000=0.0068, 150000=0.0067, 375000=0.0063, 750000=0.0063 (USD); Mounting Technology: Surface Mount; Pins: 2; Dielectric Material: Ceramic; Package Shape: Rectangular; Case/Package: 0603; Terminal Finish: Nickel; Min Operating Temperature: -55°C; Max Operating Temperature: 125°C; JESD-609 Code: e3; Value: 220pF; Capacitor Type: Ceramic; Tolerance  (fill in as +-): 5%; Package Style: SMTMeter; Packaging: Tape and Reel; Tolerance (fill in as +-): 5%; Rated DC Voltage (URdc): 50V; Temperature Characteristics Code: C0G; Termination: Wraparound; Length: 1.6mm; Width: 0.8mm; Height: 0.8mm; Reach SVHC Compliant: Yes; RoHS Compliant: Yes; ComponentLink1URL: https://datasheet.ciiva.com:443/pdfs/VipMasterIC/IC/KEME/KEME-S-A0007600110/KEME-S-A0007595965-1.pdf?src-supplier=IHS+Markit; ComponentLink1Description: https://datasheet.ciiva.com:443/pdfs/VipMasterIC/IC/KEME/KEME-S-A0007600110/KEME-S-A0007595965-1.pdf?src-supplier=IHS+Markit; ComponentLink2URL: https://datasheet.octopart.com/C0603C221J5GAC7411-KEMET-datasheet-149535035.pdf?src-supplier=Farnell; ComponentLink2Description: https://datasheet.octopart.com/C0603C221J5GAC7411-KEMET-datasheet-149535035.pdf?src-supplier=Farnell; ComponentLink3URL: https://api.kemet.com/component-edge/download/datasheet/C0603C221J5GAC7411.pdf?src-supplier=Digikey; ComponentLink3Description: https://api.kemet.com/component-edge/download/datasheet/C0603C221J5GAC7411.pdf?src-supplier=Digikey; ComponentLink4URL: https://datasheet.octopart.com/C0603C221J5GAC7411-Kemet-datasheet-11795438.pdf?src-supplier=Arrow+Electronics; ComponentLink4Description: https://datasheet.octopart.com/C0603C221J5GAC7411-Kemet-datasheet-11795438.pdf?src-supplier=Arrow+Electronics; ComponentLink5URL: https://datasheet.octopart.com/C0603C221J5GAC7411-Kemet-datasheet-5314449.pdf?src-supplier=Verical; ComponentLink5Description: https://datasheet.octopart.com/C0603C221J5GAC7411-Kemet-datasheet-5314449.pdf?src-supplier=Verical; ComponentLink6URL: https://datasheet.octopart.com/C0603C221J5GAC7411-KEMET-datasheet-157246123.pdf?src-supplier=Electro+Sonic; ComponentLink6Description: https://datasheet.octopart.com/C0603C221J5GAC7411-KEMET-datasheet-157246123.pdf?src-supplier=Electro+Sonic
C10 C11 = CC0402JRNPO9BN101: Ceramic Capacitor, Multilayer, Ceramic, 50V, 5% +Tol, 5% -Tol, C0G, 30ppm/Cel TC, 0.0001uF, Surface Mount, 0402; Manufacturer: Yageo; Multilayer: Yes; Supplier: Digikey; Supplier Part Number: 311-1024-1-ND; Manufacturer Part Number: CC0402JRNPO9BN101; RoHS: Yes; Category: Ceramic Capacitors; Stock: 5534890; Pricing: 1=0.08, 10=0.013, 100=0.008, 1000=0.0056, 2500=0.004, 10000=0.0032 (USD); Mounting Technology: Surface Mount; Pins: 2; Dielectric Material: Ceramic; Package Shape: Rectangular; Case/Package: 0402; Terminal Finish: Nickel; Min Operating Temperature: -55°C; Max Operating Temperature: 125°C; JESD-609 Code: e3; Value: 100pF; Capacitor Type: Ceramic; Tolerance  (fill in as +-): 5%; Package Style: SMTMeter; Packaging: Tape and Reel; Tolerance (fill in as +-): 5%; Rated DC Voltage (URdc): 50V; Temperature Characteristics Code: C0G; Termination: Wraparound; Length: 1mm; Width: 0.5mm; Height: 0.5mm; Reach SVHC Compliant: Yes; RoHS Compliant: Yes; ComponentLink1URL: https://datasheet.ciiva.com:443/pdfs/VipMasterIC/IC/YAGO/YAGO-S-A0009251638/YAGO-S-A0009251638-1.pdf?src-supplier=IHS+Markit; ComponentLink1Description: https://datasheet.ciiva.com:443/pdfs/VipMasterIC/IC/YAGO/YAGO-S-A0009251638/YAGO-S-A0009251638-1.pdf?src-supplier=IHS+Markit; ComponentLink2URL: https://datasheet.ciiva.com/23767/25787-23767888.pdf?src-supplier=Newark; ComponentLink2Description: https://datasheet.ciiva.com/23767/25787-23767888.pdf?src-supplier=Newark; ComponentLink3URL: https://datasheet.ciiva.com/11786/0900766b80d84fbf-11786101.pdf?src-supplier=Rs; ComponentLink3Description: https://datasheet.ciiva.com/11786/0900766b80d84fbf-11786101.pdf?src-supplier=Rs; ComponentLink4URL: https://datasheet.ciiva.com/28450/1443161-28450220.pdf?src-supplier=Element14; ComponentLink4Description: https://datasheet.ciiva.com/28450/1443161-28450220.pdf?src-supplier=Element14; ComponentLink5URL: https://datasheet.ciiva.com/143/mlccorderingcode-143989.pdf?src-supplier=Digikey; ComponentLink5Description: https://datasheet.ciiva.com/143/mlccorderingcode-143989.pdf?src-supplier=Digikey; ComponentLink6URL: https://datasheet.ciiva.com/143/mlccorderingcode-143990.pdf?src-supplier=Digikey; ComponentLink6Description: https://datasheet.ciiva.com/143/mlccorderingcode-143990.pdf?src-supplier=Digikey; ComponentLink7URL: https://datasheet.ciiva.com/143/mlccorderingcode-143991.pdf?src-supplier=Digikey; ComponentLink7Description: https://datasheet.ciiva.com/143/mlccorderingcode-143991.pdf?src-supplier=Digikey; ComponentLink8URL: https://datasheet.ciiva.com/8033/1443161-8033598.pdf?src-supplier=Element14; ComponentLink8Description: https://datasheet.ciiva.com/8033/1443161-8033598.pdf?src-supplier=Element14
C12 = CC0603JRX7R9BB104: Ceramic Capacitor, Multilayer, Ceramic, 50V, 5% +Tol, 5% -Tol, X7R, 15% TC, 0.1uF, Surface Mount, 0603; Manufacturer: Yageo; Value: 100nF; Multilayer: Yes; Supplier: Digikey; Supplier Part Number: 311-1779-1-ND; Manufacturer Part Number: CC0603JRX7R9BB104; RoHS: Yes; Category: Ceramic Capacitors; Stock: 91480; Pricing: 1=0.1, 10=0.05, 100=0.0297, 1000=0.01795 (USD); Mounting Technology: Surface Mount; Pins: 2; Dielectric Material: Ceramic; Package Shape: Rectangular; Case/Package: 0603; Terminal Finish: Nickel; Min Operating Temperature: -55°C; Max Operating Temperature: 125°C; JESD-609 Code: e3; Capacitor Type: Ceramic; Tolerance  (fill in as +-): 5%; Package Style: SMTMeter; Packaging: Tape and Reel; Tolerance (fill in as +-): 5%; Rated DC Voltage (URdc): 50V; Temperature Characteristics Code: X7R; Termination: Wraparound; Length: 1.6mm; Width: 0.8mm; Height: 0.8mm; Reach SVHC Compliant: Yes; RoHS Compliant: Yes; ComponentLink1URL: https://datasheet.ciiva.com:443/pdfs/VipMasterIC/IC/YAGO/YAGO-S-A0003557223/YAGO-S-A0003557223-1.pdf?src-supplier=IHS+Markit; ComponentLink1Description: https://datasheet.ciiva.com:443/pdfs/VipMasterIC/IC/YAGO/YAGO-S-A0003557223/YAGO-S-A0003557223-1.pdf?src-supplier=IHS+Markit; ComponentLink2URL: https://datasheet.ciiva.com/11465/upy-gphc-x7r-6-3v-to-50v-8-11465038.pdf?src-supplier=Avnet; ComponentLink2Description: https://datasheet.ciiva.com/11465/upy-gphc-x7r-6-3v-to-50v-8-11465038.pdf?src-supplier=Avnet
J1 = CONREVSMA002: RF SMA Connector; Manufacturer: Linx; Supplier: Digikey; Supplier Part Number: CONREVSMA002-ND; Manufacturer Part Number: CONREVSMA002; RoHS: Yes; Category: RF / Coaxial Connectors; Stock: 5396; Pricing: 1=2.78, 250=2.58, 500=2.41002, 1000=2.2625 (USD); Connector Type: SMA; Reach SVHC Compliant: Yes; RoHS Compliant: Yes; ComponentLink1URL: https://datasheet.ciiva.com:443/pdfs/VipMasterIC/IC/LNNC/LNNC-S-A0004850234/LNNC-S-A0004850234-1.pdf?src-supplier=IHS+Markit; ComponentLink1Description: https://datasheet.ciiva.com:443/pdfs/VipMasterIC/IC/LNNC/LNNC-S-A0004850234/LNNC-S-A0004850234-1.pdf?src-supplier=IHS+Markit; ComponentLink2URL: https://datasheet.ciiva.com/644/conrevsma002-644109.pdf?src-supplier=Digikey; ComponentLink2Description: https://datasheet.ciiva.com/644/conrevsma002-644109.pdf?src-supplier=Digikey; ComponentLink3URL: https://datasheet.ciiva.com/16225/conrevsma002-16225213.pdf?src-supplier=Future+Electronics; ComponentLink3Description: https://datasheet.ciiva.com/16225/conrevsma002-16225213.pdf?src-supplier=Future+Electronics
L1 = LQG18HNR10J00D: General Purpose Inductor, 0.1uH, 5%, 1 Element, Air-Core, SMD, 0603; Manufacturer: Murata; Core Material: Air; Case/Size Code: 0603; DC Resistance (DCR): 900mR; Inductor Application: RF INDUCTOR; Channels: 1; Quality Factor-Min (at L-nom): 12; Max Current Rating: 350mA; Self Resonant Frequency: 800MHz; Shape/Size Description: RECTANGULAR PACKAGE; Shielding: Unshielded; Test Frequency: 100MHz; Package Height: 0.8mm; Package Length: 1.6mm; Supplier: Digikey; Supplier Part Number: 490-6586-1-ND; Manufacturer Part Number: LQG18HNR10J00D; RoHS: Yes; Category: Fixed Inductors; Stock: 24486; Pricing: 1=0.18, 10=0.144, 50=0.144, 100=0.119, 1000=0.098, 10000=0.066 (USD); Pins: 2; Terminal Finish: Tin; Min Operating Temperature: -40°C; Max Operating Temperature: 85°C; Tolerance: 5%; JESD-609 Code: e3; Construction: Multilayer Chip; Inductance-Nom (L): 0.1uH; Inductor Type: GENERAL PURPOSE INDUCTOR; Package Style: SMTMeter; Packaging: Tape and Reel; Surface Mount: Yes; Terminal Placement: Dual Ended; Termination: Wraparound; Package Width: 0.8mm; Reach SVHC Compliant: Yes; RoHS Compliant: Yes; ComponentLink1URL: https://datasheet.ciiva.com:443/pdfs/VipMasterIC/IC/MURE/MURE-S-A0008911298/MURE-S-A0008911379-1.pdf?src-supplier=IHS+Markit; ComponentLink1Description: https://datasheet.ciiva.com:443/pdfs/VipMasterIC/IC/MURE/MURE-S-A0008911298/MURE-S-A0008911379-1.pdf?src-supplier=IHS+Markit; ComponentLink2URL: https://datasheet.ciiva.com/11801/0900766b80f1087c-11801431.pdf?src-supplier=Rs; ComponentLink2Description: https://datasheet.ciiva.com/11801/0900766b80f1087c-11801431.pdf?src-supplier=Rs; ComponentLink3URL: https://datasheet.ciiva.com/6710/l0075s0083lqg18h-6710060.pdf?src-supplier=Digikey; ComponentLink3Description: https://datasheet.ciiva.com/6710/l0075s0083lqg18h-6710060.pdf?src-supplier=Digikey; ComponentLink4URL: https://datasheet.ciiva.com/6710/l0075s0083lqg18h-6710062.pdf?src-supplier=Digikey; ComponentLink4Description: https://datasheet.ciiva.com/6710/l0075s0083lqg18h-6710062.pdf?src-supplier=Digikey; ComponentLink5URL: https://datasheet.ciiva.com/8002/5102-8002605.pdf?src-supplier=Element14; ComponentLink5Description: https://datasheet.ciiva.com/8002/5102-8002605.pdf?src-supplier=Element14; ComponentLink6URL: https://datasheet.ciiva.com/8002/5102-8002606.pdf?src-supplier=Element14; ComponentLink6Description: https://datasheet.ciiva.com/8002/5102-8002606.pdf?src-supplier=Element14
R12 = RT0402BRE0750RL: Fixed Resistor, Thin Film, 0.0625W, 50ohm, 50V, 0.1% +/-Tol, 50ppm/Cel, Surface Mount, 0402; Manufacturer: Yageo; Additional Feature: LASER TRIMMABLE; Power: 62.5mW; Rated Temperature: 70°C; Value: 50R; Supplier: Digikey; Supplier Part Number: 13-RT0402BRE0750RLCT-ND; Manufacturer Part Number: RT0402BRE0750RL; RoHS: Yes; Category: Chip SMD Resistors; Stock: 2520; Pricing: 1=0.18, 10=0.133, 50=0.1072, 100=0.0959, 500=0.0765, 1000=0.06834, 5000=0.05406 (USD); Mounting Technology: Surface Mount; Pins: 2; Package Shape: Rectangular; Case/Package: 0402; Min Operating Temperature: -55°C; Max Operating Temperature: 155°C; Tolerance: 0.1%; Resistor Type: FIXED RESISTOR; Packaging: Tape and Reel; Technology: THIN FILM; Termination: Wraparound; Working Voltage: 50V; Temperature Coefficient (ppm/Cel): 50; Reach SVHC Compliant: Yes; RoHS Compliant: Yes; ComponentLink1URL: https://datasheet.ciiva.com:443/pdfs/VipMasterIC/IC/YAGO/YAGO-S-A0003507815/YAGO-S-A0003507815-1.pdf?src-supplier=IHS+Markit; ComponentLink1Description: https://datasheet.ciiva.com:443/pdfs/VipMasterIC/IC/YAGO/YAGO-S-A0003507815/YAGO-S-A0003507815-1.pdf?src-supplier=IHS+Markit; ComponentLink2URL: http://www.yageo.com/documents/recent/PYu-RT_1-to-0.01_RoHS_L_9.pdf?src-supplier=Digikey; ComponentLink2Description: http://www.yageo.com/documents/recent/PYu-RT_1-to-0.01_RoHS_L_9.pdf?src-supplier=Digikey; ComponentLink3URL: https://datasheet.octopart.com/RT0402BRE0750RL-Yageo-datasheet-166250672.pdf?src-supplier=Future+Electronics; ComponentLink3Description: https://datasheet.octopart.com/RT0402BRE0750RL-Yageo-datasheet-166250672.pdf?src-supplier=Future+Electronics
U3 = MAX2750AUA+: Voltage Controlled Oscillator, 2370MHz Min, 2470MHz Max; Manufacturer: Maxim; Package Body Material: Plastic; Operating Frequency-Max: 2.47GHz; Operating Frequency-Min: 2.37GHz; Control Voltage-Max: 2.4V; Control Voltage-Min: 400mV; Offset Frequency: 4MHz; Output Power (dBm): -3dBm; Package Equivalence Code: TSSOP8,.19; Phase Noise: -125dBc/Hz; Power Supplies: 3/5V; Max Supply Current: 21mA; Max Supply Voltage: 5.5V; Min Supply Voltage: 2.7V; Qualification Status: Not Qualified; Supplier: Digikey; Supplier Part Number: MAX2750AUA+-ND; Manufacturer Part Number: MAX2750AUA+; RoHS: Yes; Category: Oscillators; Stock: 638; Pricing: 1=8.28, 10=7.191, 50=6.5428, 100=6.29, 250=5.97796, 500=5.7577, 1000=5.5503 (USD); Mounting Technology: Surface Mount; Pins: 8; Terminal Finish: Tin; Min Operating Temperature: -40°C; Max Operating Temperature: 125°C; JESD-609 Code: e3; Oscillator Type: VOLTAGE CONTROLLED OSCILLATOR; Manufacturer Series: MAX2750AUA; Reach SVHC Compliant: Yes; RoHS Compliant: Yes; ComponentLink1URL: https://datasheet.ciiva.com:443/pdfs/VipMasterIC/IC/MAXM/MAXM-S-A0000999237/MAXM-S-A0000999237-1.pdf?src-supplier=IHS+Markit; ComponentLink1Description: https://datasheet.ciiva.com:443/pdfs/VipMasterIC/IC/MAXM/MAXM-S-A0000999237/MAXM-S-A0000999237-1.pdf?src-supplier=IHS+Markit; ComponentLink2URL: https://datasheet.ciiva.com/2796/max2750aua-2796961.pdf?src-supplier=Digikey; ComponentLink2Description: https://datasheet.ciiva.com/2796/max2750aua-2796961.pdf?src-supplier=Digikey; ComponentLink3URL: https://datasheet.ciiva.com/12071/max2750aua-73109-12071954.pdf?src-supplier=Mouser; ComponentLink3Description: https://datasheet.ciiva.com/12071/max2750aua-73109-12071954.pdf?src-supplier=Mouser
U4 = ADL5545ARKZ-R7: Wide Band Medium Power Amplifier, 30MHz Min, 6000MHz Max, 1 Func, BIPolar; Manufacturer: Analog Devices; Supplier: Digikey; Supplier Part Number: 505-ADL5545ARKZ-R7CT-ND; Manufacturer Part Number: ADL5545ARKZ-R7; RoHS: Yes; Category: RF Amplifiers; Stock: 532; Pricing: 1=4.14, 10=3.577, 25=3.3816, 100=3.1132, 250=2.95236, 500=2.83876 (USD); RF/Microwave Device Type: WIDE BAND MEDIUM POWER; Reach SVHC Compliant: Yes; RoHS Compliant: Yes; ComponentLink1URL: https://datasheet.ciiva.com:443/pdfs/VipMasterIC/IC/ANDI/ANDIS19839/ANDIS19839-1.pdf?src-supplier=IHS+Markit; ComponentLink1Description: https://datasheet.ciiva.com:443/pdfs/VipMasterIC/IC/ANDI/ANDIS19839/ANDIS19839-1.pdf?src-supplier=IHS+Markit; ComponentLink2URL: https://datasheet.ciiva.com/18576/adl5545-18576150.pdf?src-supplier=Digikey; ComponentLink2Description: https://datasheet.ciiva.com/18576/adl5545-18576150.pdf?src-supplier=Digikey; ComponentLink3URL: https://datasheet.ciiva.com/22628/1800592-22628003.pdf?src-supplier=Element14; ComponentLink3Description: https://datasheet.ciiva.com/22628/1800592-22628003.pdf?src-supplier=Element14; ComponentLink4URL: https://datasheet.ciiva.com/18576/adl5545-18576151.pdf?src-supplier=Digikey; ComponentLink4Description: https://datasheet.ciiva.com/18576/adl5545-18576151.pdf?src-supplier=Digikey; ComponentLink5URL: https://datasheet.ciiva.com/18576/adl5545-18576152.pdf?src-supplier=Digikey; ComponentLink5Description: https://datasheet.ciiva.com/18576/adl5545-18576152.pdf?src-supplier=Digikey
U9 = BDCN-10-25+: Bi-Directional Coupler, 824MHz Min, 2525MHz Max, 1.5dB Insertion Loss-Max; Manufacturer: Mini-Circuits; Characteristic Impedance: 50R; Operating Frequency-Max: 2.525GHz; VSWR-Max: 1.2; Supplier: Digikey; Supplier Part Number: 3157-BDCN-10-25+CT-ND; Manufacturer Part Number: BDCN-10-25+; RoHS: Yes; Stock: 5826; Pricing: 1=5.44, 20=4.932, 50=4.476, 100=4.176, 200=3.84, 500=3.55202, 1000=3.5037 (USD); Terminal Finish: Nickel; Min Operating Temperature: -55°C; Max Operating Temperature: 100°C; JESD-609 Code: e3; Construction: COMPONENT; Insertion Loss-Max: 1.5dB; Operating Frequency-Min: 824MHz; RF/Microwave Device Type: BI-DIRECTIONAL COUPLER; Reach SVHC Compliant: Yes; RoHS Compliant: Yes; ComponentLink1URL: https://datasheet.ciiva.com:443/pdfs/VipMasterIC/IC/MINI/MINI-S-A0002822080/MINI-S-A0002822080-1.pdf?src-supplier=IHS+Markit; ComponentLink1Description: https://datasheet.ciiva.com:443/pdfs/VipMasterIC/IC/MINI/MINI-S-A0002822080/MINI-S-A0002822080-1.pdf?src-supplier=IHS+Markit; ComponentLink2URL: http://datasheet.octopart.com/BDCN-10-25%2B-Mini-Circuits-datasheet-8617095.pdf?src-supplier=Digikey; ComponentLink2Description: http://datasheet.octopart.com/BDCN-10-25%2B-Mini-Circuits-datasheet-8617095.pdf?src-supplier=Digikey; ComponentLink3URL: http://datasheet.octopart.com/BDCN-10-25%2B-Mini-Circuits-datasheet-8617095.pdf?src-supplier=Mouser; ComponentLink3Description: http://datasheet.octopart.com/BDCN-10-25%2B-Mini-Circuits-datasheet-8617095.pdf?src-supplier=Mouser